# EasyEDA Pro project 21届智能车+蚂蚁搬家+主驱一体PCB文件.epro, schematic Schematic4

## Sheets
1 核心板: Board Name: V4.0(20260210); Create Date: 2026-02-10; Page Name: 核心板; Project Name: NXP_micropython主驱一体; Schematic Name: Schematic4; Update Date: 2026-02-18; BladeWidth: 10; Company: 嘉立创EDA; Page Size: A4; RegionStart: 1; ShowBorder: 1; TitleBlock: 1; TitleBlockPosition: 3; Version: V1.0; XRegionCount: 6; YRegionCount: 4
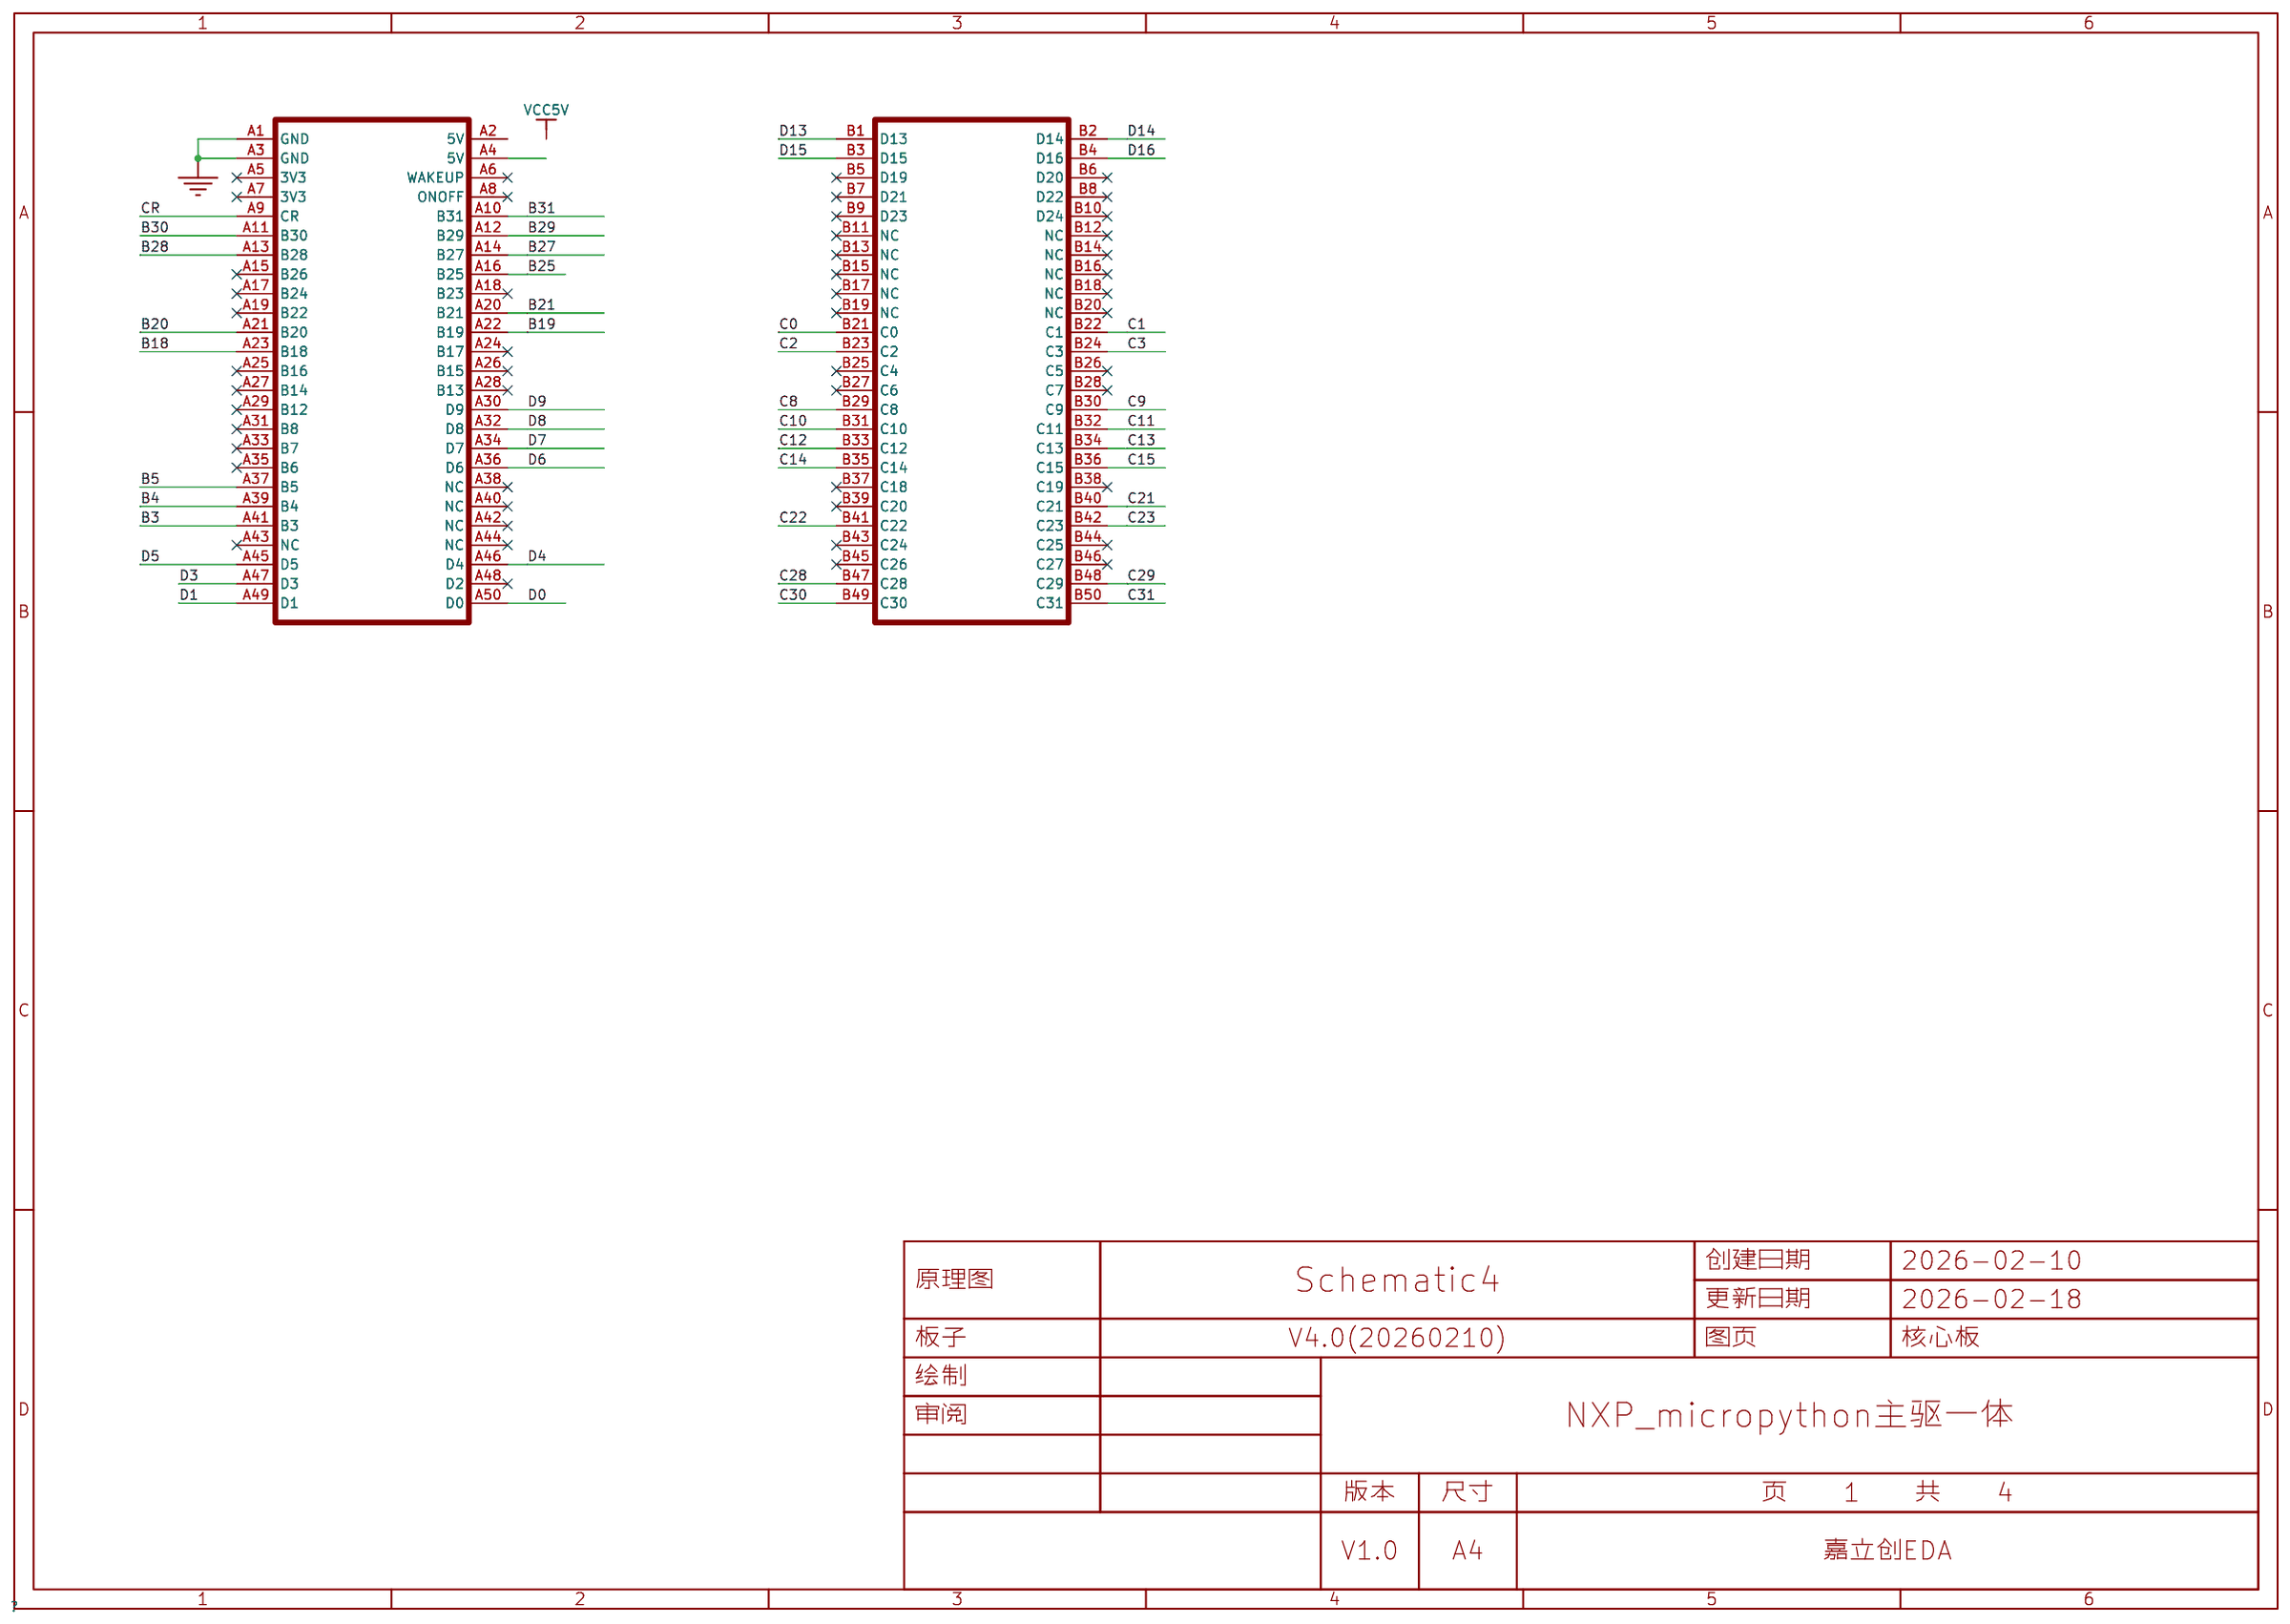
[diagram p3: 核心板]
2 电源: Page Name: 电源; Update Date: 2026-02-17
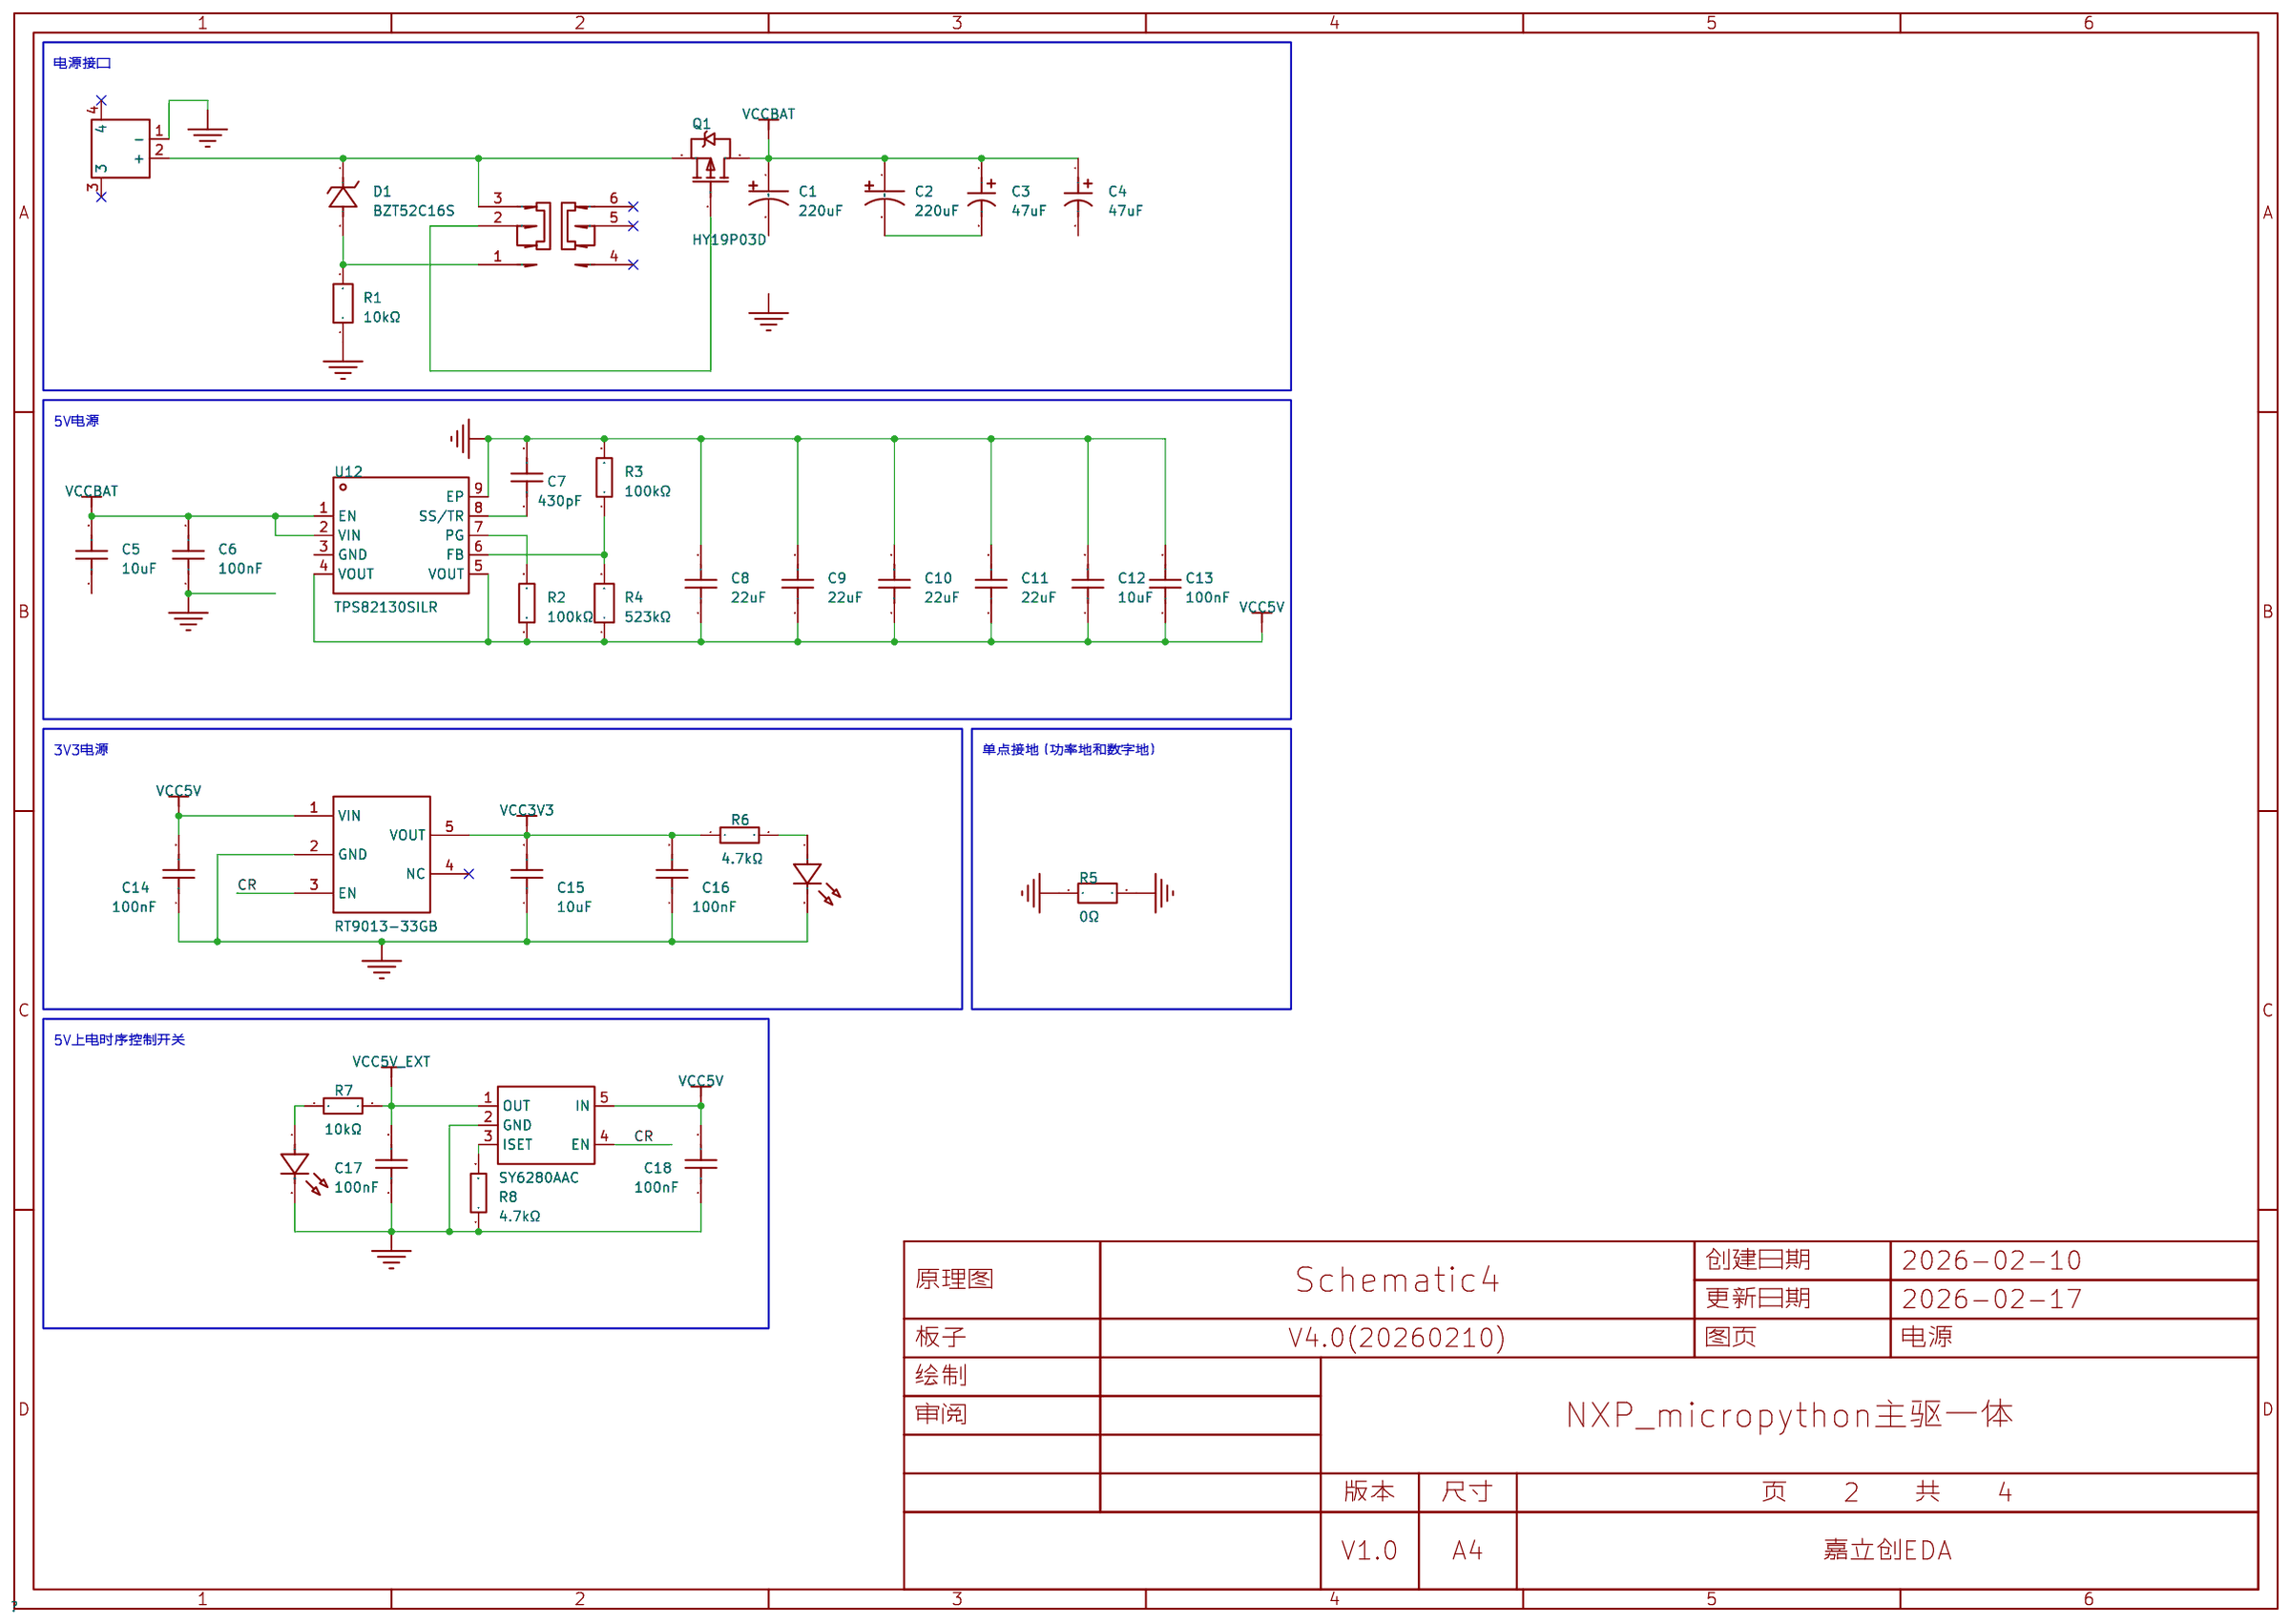
[diagram p4: 电源]
3 外设: Page Name: 外设; Update Date: 2026-02-19
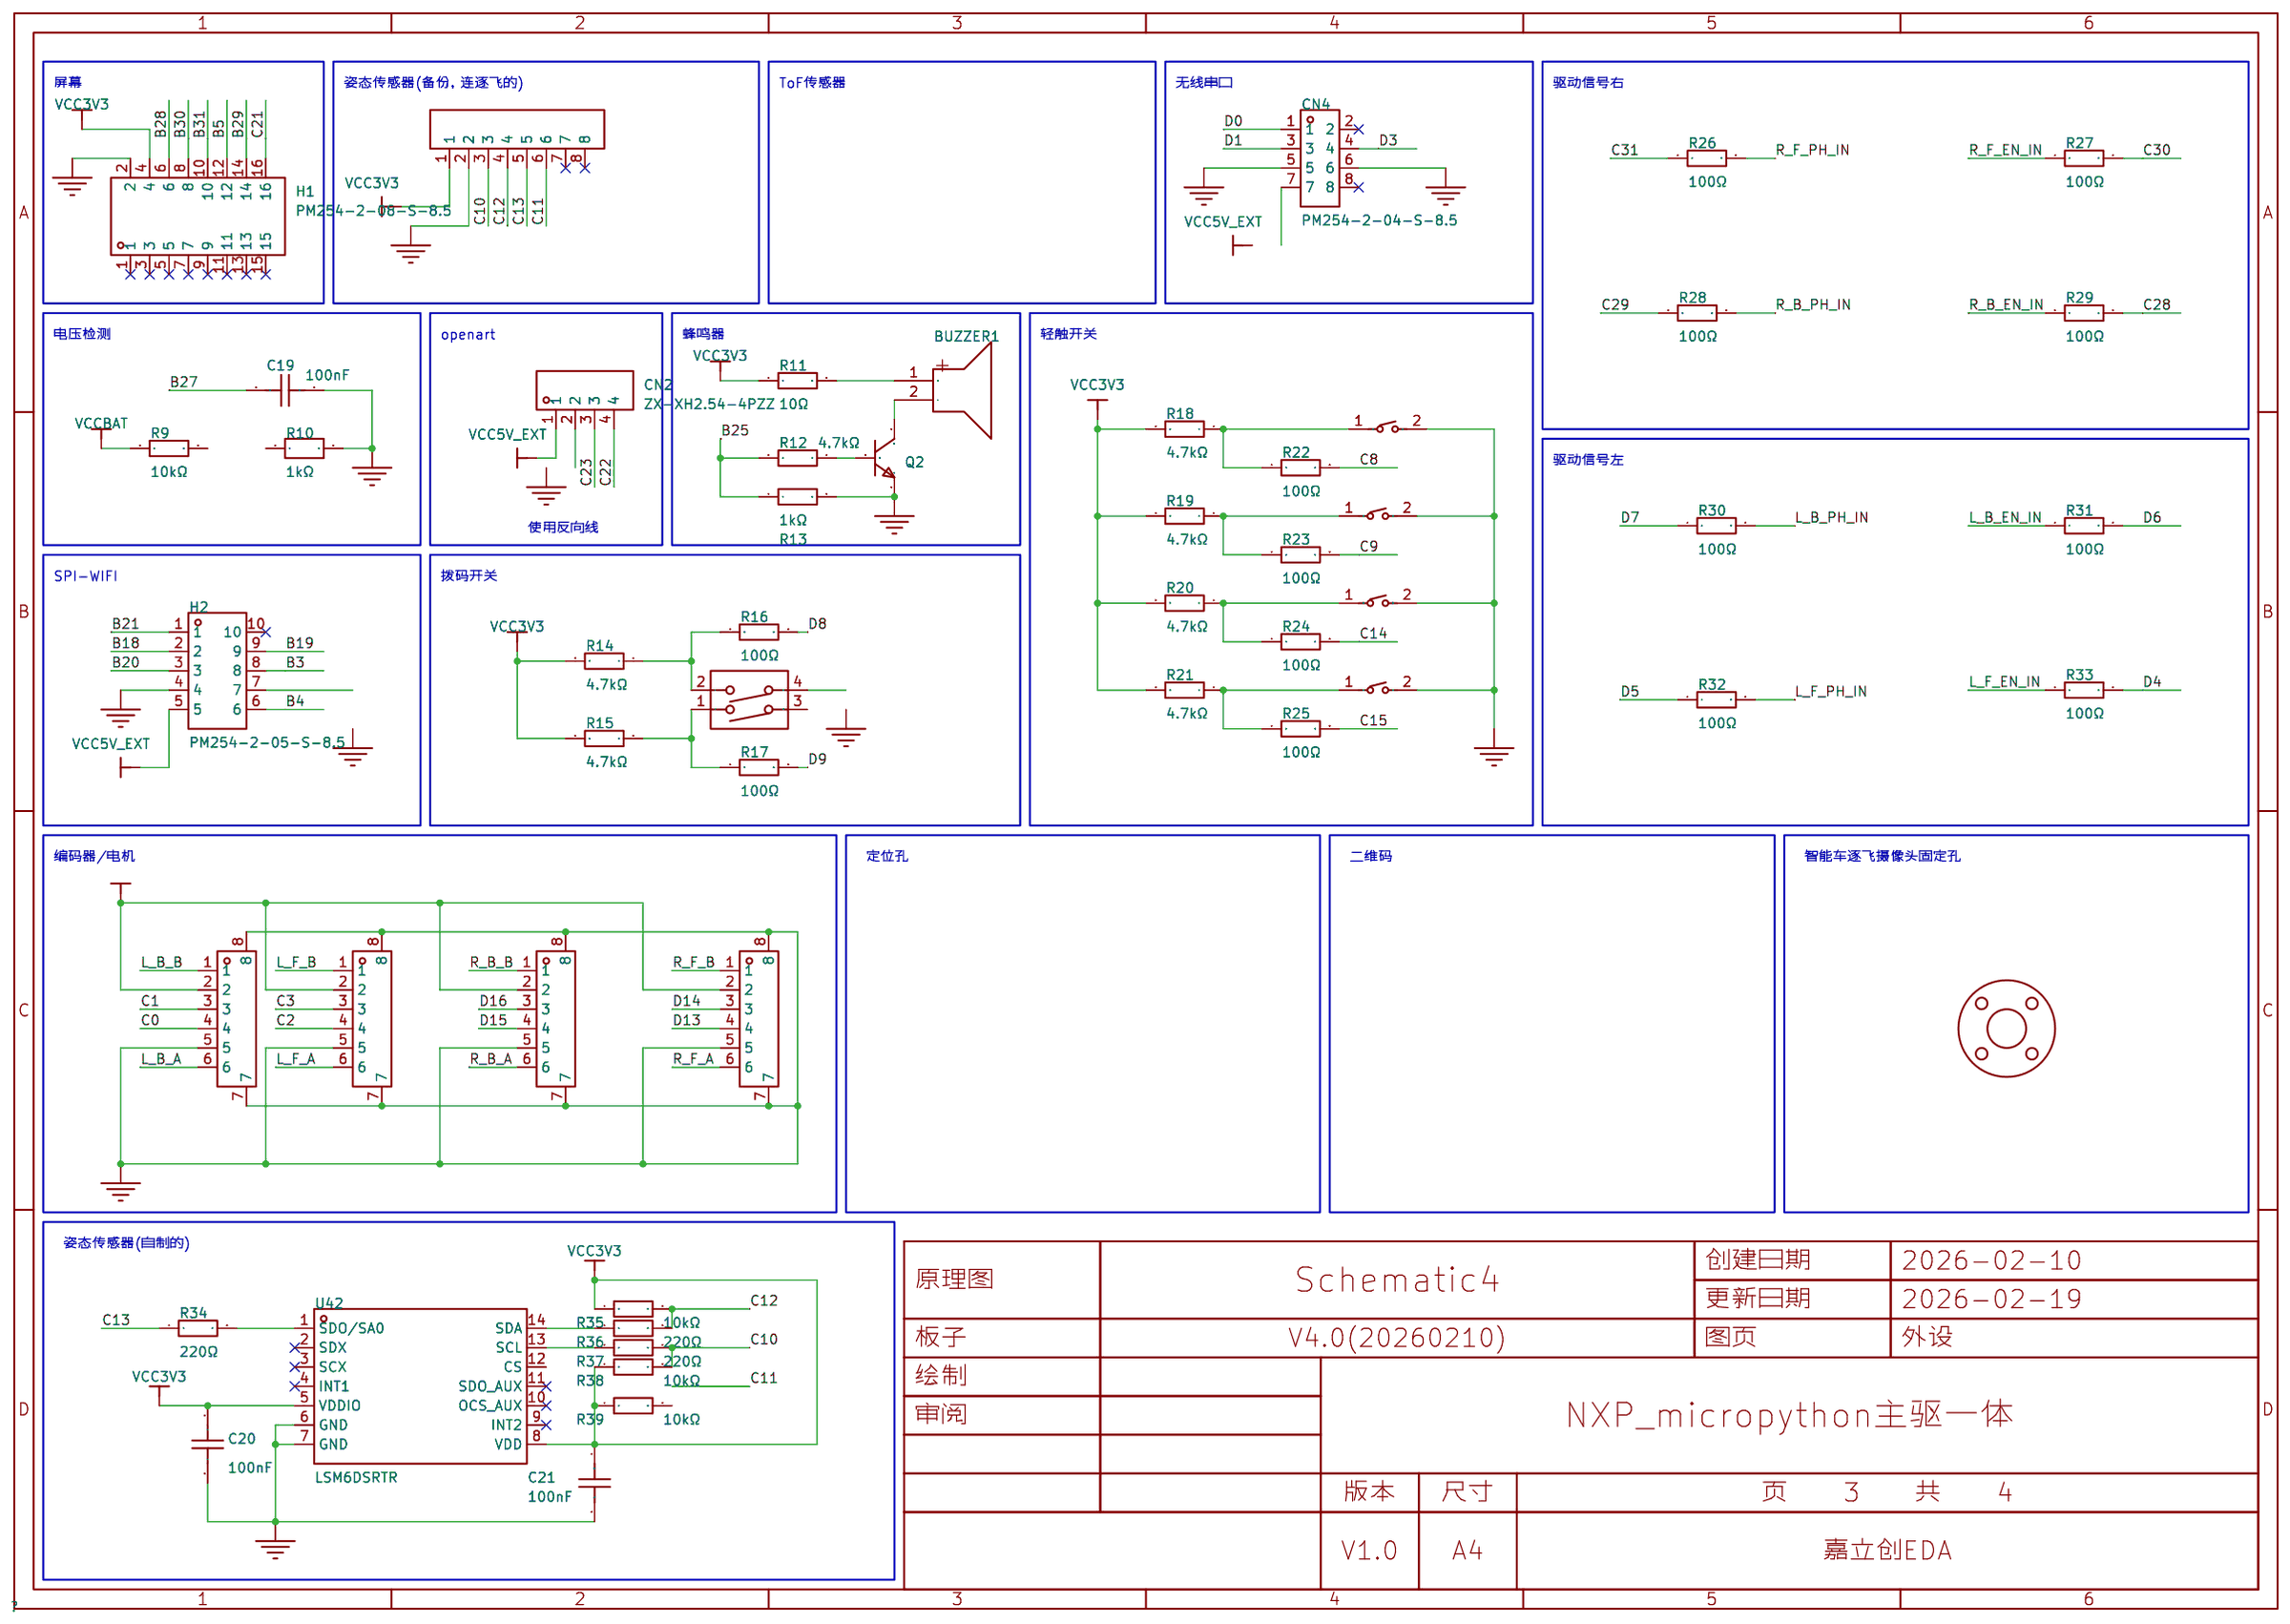
[diagram p5: 外设]
4 驱动: Page Name: 驱动; Update Date: 2026-02-17
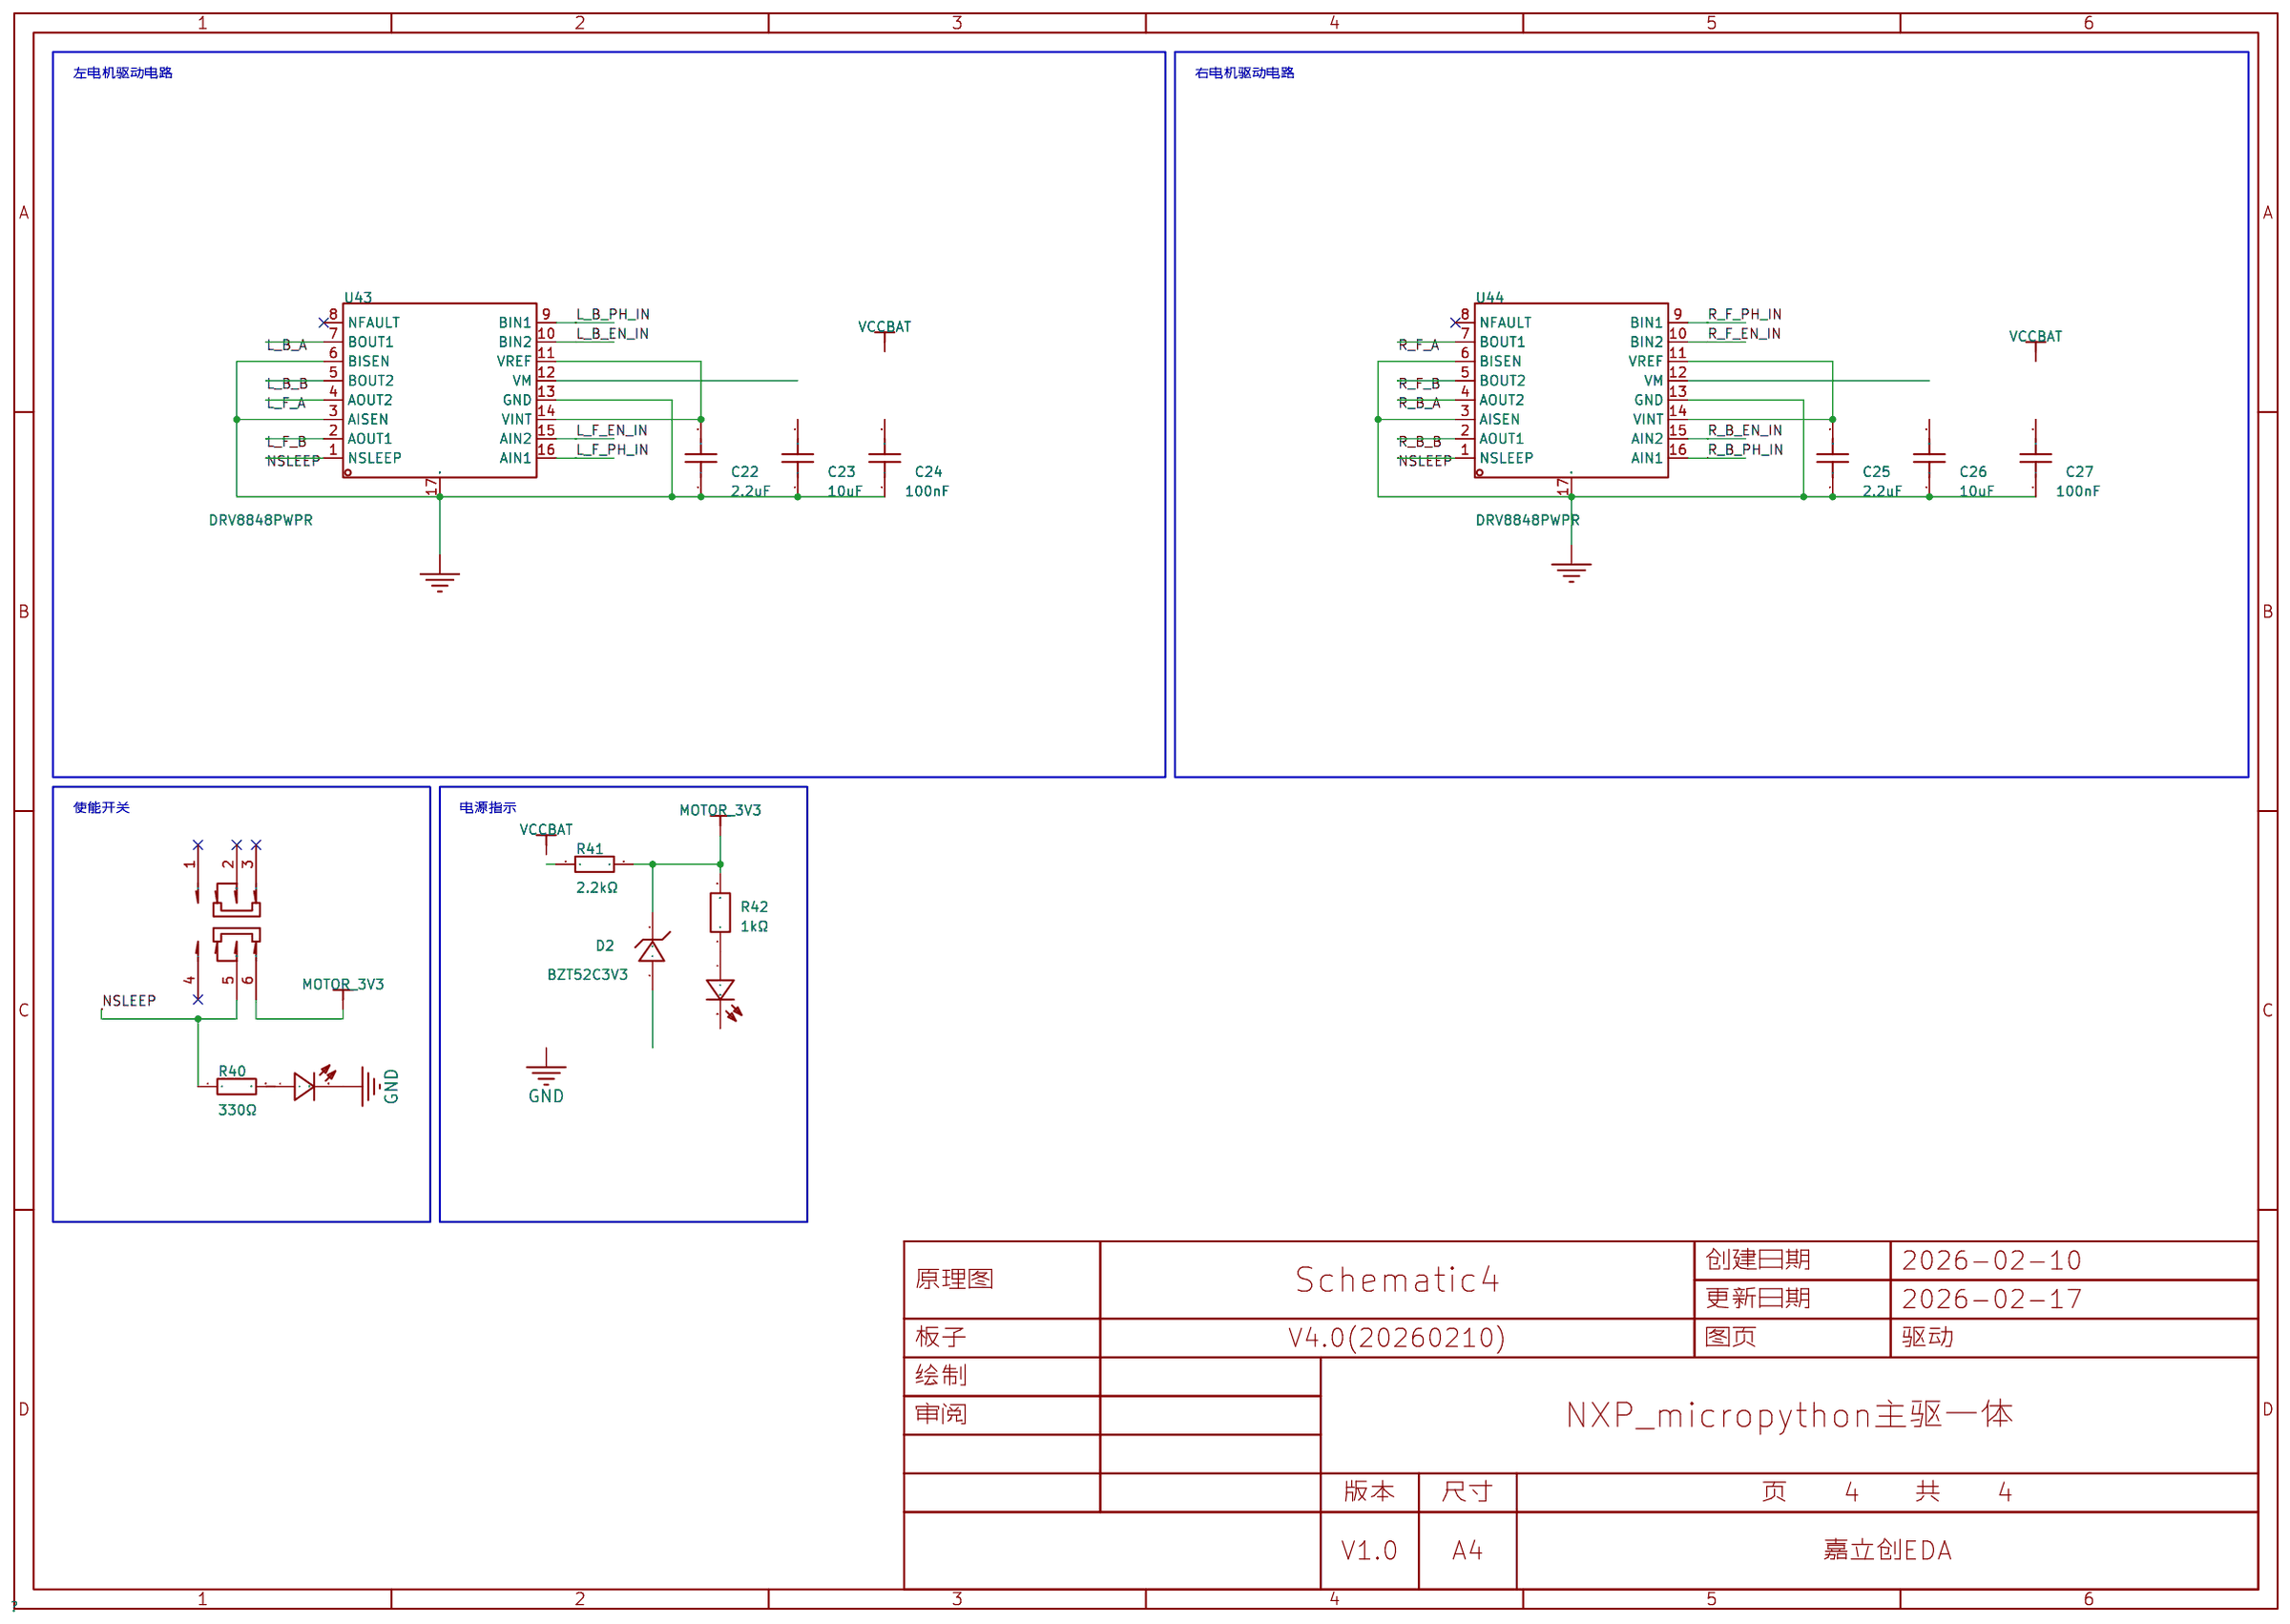
[diagram p6: 驱动]

## Parts
sheet 外设
BUZZER1  3kHz  [BUZ-TH_BD9.0-P5.00-D0.6-FD]
C19  100nF  [C0603]
C20  100nF  [C0603]
C21  100nF  [C0603]
CN2  ZX-XH2.54-4PZZ  [CONN-TH_4P-P2.50_4PIN]
CN4  PM254-2-04-S-8.5  [HDR-SMD_8P-P2.54-V-F-R2-C4-S7.1]
FH2  智能车逐飞摄像头固定孔  [智能车逐飞摄像头支架固定孔]
H1  PM254-2-08-S-8.5  [HDR-SMD_16P-P2.54-V-F-R2-C8-LS7.1]
H2  PM254-2-05-S-8.5  [HDR-SMD_10P-P2.54-V-F-R2-C5-LS7.1-1]
P5  2.54-1*8P母环保  [HDR-TH_8P-P2.54-V-F_2]
Q2  S8050 J3Y(RANGE:200-350)  [SOT-23-3_L3.0-W1.7-P0.95-LS2.9-BR]
R9  10kΩ  [R0603]
R10  1kΩ  [R0603]
R11  10Ω  [R0603]
R12  4.7kΩ  [R0603]
R13  1kΩ  [R0603]
R14  4.7kΩ  [R0603]
R15  4.7kΩ  [R0603]
R16  100Ω  [R0603]
R17  100Ω  [R0603]
R18  4.7kΩ  [R0603]
R19  4.7kΩ  [R0603]
R20  4.7kΩ  [R0603]
R21  4.7kΩ  [R0603]
R22  100Ω  [R0603]
R23  100Ω  [R0603]
R24  100Ω  [R0603]
R25  100Ω  [R0603]
R26  100Ω  [R0603]
R27  100Ω  [R0603]
R28  100Ω  [R0603]
R29  100Ω  [R0603]
R30  100Ω  [R0603]
R31  100Ω  [R0603]
R32  100Ω  [R0603]
R33  100Ω  [R0603]
R34  220Ω  [R0603]
R35  10kΩ  [R0603]
R36  220Ω  [R0603]
R37  220Ω  [R0603]
R38  10kΩ  [R0603]
R39  10kΩ  [R0603]
SW3  DSWB02LHGET  [SW-TH_DSWB02LHGET]
U8  ZX-QC34-2TPDZ  [KEY-SMD_L3.9-W3.0-LS5.0-EH]
U9  ZX-QC34-2TPDZ  [KEY-SMD_L3.9-W3.0-LS5.0-EH]
U10  ZX-QC34-2TPDZ  [KEY-SMD_L3.9-W3.0-LS5.0-EH]
U11  ZX-QC34-2TPDZ  [KEY-SMD_L3.9-W3.0-LS5.0-EH]
U42  LSM6DSRTR  [LGA-14_L3.0-W2.5-P0.50-BR]
U46  ZX-ZH1.5-6PLT  [CONN-SMD_6P-P1.50_ZX-ZH1.5-6PLT]
U47  ZX-ZH1.5-6PLT  [CONN-SMD_6P-P1.50_ZX-ZH1.5-6PLT]
U48  ZX-ZH1.5-6PLT  [CONN-SMD_6P-P1.50_ZX-ZH1.5-6PLT]
U49  ZX-ZH1.5-6PLT  [CONN-SMD_6P-P1.50_ZX-ZH1.5-6PLT]
sheet 核心板
U3  RT1021_BTB_CoreBoard  [RT1021_BTB_COREBOARD]  (sections 1,2)
sheet 电源
C1  220uF  [CAP-SMD_BD6.3-L6.6-W6.6-LS7.2-R-RD]
C2  220uF  [CAP-SMD_BD6.3-L6.6-W6.6-LS7.2-R-RD]
C3  47uF  [CAP-SMD_BD5.0-L5.3-W5.3-LS5.9-FD]
C4  47uF  [CAP-SMD_BD5.0-L5.3-W5.3-LS5.9-FD]
C5  10uF  [C0603]
C6  100nF  [C0603]
C7  430pF  [C0603]
C8  22uF  [C0603]
C9  22uF  [C0603]
C10  22uF  [C0603]
C11  22uF  [C0603]
C12  10uF  [C0603]
C13  100nF  [C0603]
C14  100nF  [C0603]
C15  10uF  [C0603]
C16  100nF  [C0603]
C17  100nF  [C0603]
C18  100nF  [C0603]
CN9  XT30PW-M30.G.Y  [CONN-TH_XT30PW-M]
D1  BZT52C16S  [SOD-323_L1.7-W1.3-LS2.6-RD]
Q1  HY19P03D  [TO-252-2_L6.6-W6.1-P4.57-LS9.9-TL-CW]
R1  10kΩ  [R0603]
R2  100kΩ  [R0603]
R3  100kΩ  [R0603]
R4  523kΩ  [R0603]
R5  0Ω  [R1206]
R6  4.7kΩ  [R0603]
R7  10kΩ  [R0603]
R8  4.7kΩ  [R0603]
U1  RT9013-33GB  [SOT-23-5_L3.0-W1.7-P0.95-LS2.8-BR]
U2  42-51/GHC-YW2X2K/3T  [LED-SMD_L1.6-W0.8-FD_GREEN-1]
U4  42-51/GHC-YW2X2K/3T  [LED-SMD_L1.6-W0.8-FD_GREEN-1]
U6  SY6280AAC  [SOT-23-5_L3.0-W1.7-P0.95-LS2.8-BR]
U12  TPS82130SILR  [USIP-8_L3.0-W2.8-P0.65-TL-EP]
U41  SS-3235S-L1  [SW-SMD_SS-3235S-LX]
sheet 驱动
C22  2.2uF  [C0603]
C23  10uF  [C0603]
C24  100nF  [C0603]
C25  2.2uF  [C0603]
C26  10uF  [C0603]
C27  100nF  [C0603]
D2  BZT52C3V3  [SOD-123_L2.8-W1.8-LS3.7-RD]
LED1  Blue  [LEDC1608(0603)]
LED2  =Color  [LEDC1608(0603)]
R40  330Ω  [R0603]
R41  2.2kΩ  [R0603]
R42  1kΩ  [R0603]
U5  SS-3235S-L1  [SW-SMD_SS-3235S-LX]
U43  DRV8848PWPR  [HTSSOP-16_L5.0-W4.4-P0.65-LS6.4-BL-EP]
U44  DRV8848PWPR  [HTSSOP-16_L5.0-W4.4-P0.65-LS6.4-BL-EP]

## Library data of the parts
BUZZER1 = HNB09A03: 驱动方式:有源(内含驱动线路);构造类型:电磁式;频率:3kHz;声压(SPL):85dB;; LCSC Part Name: 电磁式有源一体蜂鸣器HNB09A03; Supplier Part: C96102; Manufacturer: 华能; Supplier Footprint: 插件,D=9mm; JLCPCB Part Class: 扩展库; Datasheet: https://atta.szlcsc.com/upload/public/pdf/source/20241128/61C4C8C3938BB25F7C38FBE94CCE8DCF.pdf; Supplier: LCSC; Driver Circuitry: 有源(内含驱动线路); Technology: 电磁式; Voltage - Supply: 1.5V~4.5V; Current Consumption: 30mA; Sound Pressure Level(SPL): 85dB; Diameter(φD): 9mm; Height: 5.5mm; Operating Temperature: -20℃~+70℃
C6 C13 C14 C16-C21 C24 C27 = CL10B104KB8NNNC: 容值:100nF;精度:±10%;额定电压:50V;温度系数:X7R;; LCSC Part Name: 100nF ±10% 50V; Supplier Part: C1591; Manufacturer: SAMSUNG(三星); Supplier Footprint: 0603; JLCPCB Part Class: 扩展库; Datasheet: https://item.szlcsc.com/datasheet/CL10B104KB8NNNC/1943.html; Supplier: LCSC; Tolerance: ±10%; Voltage Rating: 50V; Temperature Coefficient: X7R
CN2 = ZX-XH2.54-4PZZ: 插针结构:1x4P;间距:2.5mm;安装方式:直插;参考系列:XH;总PIN数:4P;排数:1;每排PIN数:4;行距:-;额定电流:3A;触头材质:黄铜;触头镀层:锡;工作温度:-25℃~+85℃;; LCSC Part Name: 1x4P 间距:2.5mm 直插 系列:XH; Supplier Part: C7429634; Manufacturer: Megastar(兆星); Supplier Footprint: 插件,P=2.5mm; JLCPCB Part Class: 扩展库; Datasheet: https://item.szlcsc.com/datasheet/ZX-XH2.54-4PZZ/8427551.html; Supplier: LCSC; Pins Structure: 1x4P; Pitch: 2.5mm; Mounting Type: 直插; Reference Series: XH; Number of Pins: 4P; Number of Rows: 1; Number of PINs Per Row: 4; Current Rating: 3A; Contact Material: 黄铜; Contact Plating: 锡; Operating Temperature: -25℃~+85℃; Voltage Rating: 250V; Plastic Material: PA66; Flame Retardant Rating: UL94V-0; Color: 白色; Z-Height of the Board: 7mm; X-Length of Bottom Edge on Board (Spacing Line): 12.5mm; Y-Width of Bottom Edge on Board: 5.9mm
CN4 = PM254-2-04-S-8.5: 插孔结构:2x4P;间距:2.54mm;行距:2.54mm;圆孔/方孔:方孔;安装方式:立贴;排数:双排;总孔位数:8P;额定电流:3A;插孔方向:顶部;塑高:8.5mm;触头材质:铜合金;工作温度:-40℃~+105℃;; LCSC Part Name: 2x4P 间距:2.54mm 立贴; Supplier Part: C3975149; Manufacturer: HCTL(华灿天禄); Supplier Footprint: SMD,P=2.54mm; JLCPCB Part Class: 扩展库; Datasheet: https://item.szlcsc.com/datasheet/PM254-2-04-S-8.5/4543700.html; Supplier: LCSC; Holes Structure: 2x4P; Pitch: 2.54mm; Row Spacing: 2.54mm; Circular Hole / Square Hole: 方孔; Mounting Type: 立贴; Number of Rows: 双排; Number of Positions: 8P; Current Rating: 3A; Holes Direction: 顶部; Insulation Height: 8.5mm; Contact Material: 铜合金; Operating Temperature: -40℃~+105℃
FH2 = 智能车逐飞摄像头固定孔: 3DModel: 逐飞摄像头法兰盘-Body
H1 = PM254-2-08-S-8.5: 插孔结构:2x8P;间距:2.54mm;行距:2.54mm;圆孔/方孔:方孔;安装方式:立贴;排数:双排;总孔位数:16P;额定电流:3A;插孔方向:顶部;塑高:8.5mm;触头材质:铜合金;工作温度:-40℃~+105℃;; LCSC Part Name: 2x8P 间距:2.54mm 立贴; Supplier Part: C3975153; Manufacturer: HCTL(华灿天禄); Supplier Footprint: SMD,P=2.54mm; JLCPCB Part Class: 扩展库; Datasheet: https://item.szlcsc.com/datasheet/PM254-2-08-S-8.5/4543704.html; Supplier: LCSC; Holes Structure: 2x8P; Pitch: 2.54mm; Row Spacing: 2.54mm; Circular Hole / Square Hole: 方孔; Mounting Type: 立贴; Number of Rows: 双排; Number of Positions: 16P; Current Rating: 3A; Holes Direction: 顶部; Insulation Height: 8.5mm; Contact Material: 铜合金; Operating Temperature: -40℃~+105℃
H2 = PM254-2-05-S-8.5: 插孔结构:2x5P;间距:2.54mm;行距:2.54mm;圆孔/方孔:方孔;安装方式:立贴;排数:双排;总孔位数:10P;额定电流:3A;插孔方向:顶部;塑高:8.5mm;触头材质:铜合金;工作温度:-40℃~+105℃;; LCSC Part Name: 2x5P 间距:2.54mm 立贴; Supplier Part: C3975150; Manufacturer: HCTL(华灿天禄); Supplier Footprint: SMD,P=2.54mm; JLCPCB Part Class: 扩展库; Datasheet: https://item.szlcsc.com/datasheet/PM254-2-05-S-8.5/4543701.html; Supplier: LCSC; Holes Structure: 2x5P; Pitch: 2.54mm; Row Spacing: 2.54mm; Circular Hole / Square Hole: 方孔; Mounting Type: 立贴; Number of Rows: 双排; Number of Positions: 10P; Current Rating: 3A; Holes Direction: 顶部; Insulation Height: 8.5mm; Contact Material: 铜合金; Operating Temperature: -40℃~+105℃
P5 = 2.54-1*8P母环保: 插孔结构:1x8P;间距:2.54mm;行距:-;圆孔/方孔:方孔;安装方式:直插;排数:单排;总孔位数:8P;插孔方向:顶部;塑高:-;触头材质:-;触头镀层:-;; LCSC Part Name: 1x8P 间距:2.54mm 直插; Supplier Part: C27438; Manufacturer: BOOMELE(博穆精密); Supplier Footprint: 插件,P=2.54mm; JLCPCB Part Class: 扩展库; Datasheet: https://item.szlcsc.com/datasheet/2.54-1*8P%25E6%25AF%258D%25E7%258E%25AF%25E4%25BF%259D/28187.html; Supplier: LCSC; Holes Structure: 1x8P; Pitch: 2.54mm; Circular Hole / Square Hole: 方孔; Mounting Type: 直插; Number of Rows: 单排; Number of Positions: 8P; Holes Direction: 顶部
Q2 = S8050 J3Y(RANGE:200-350): 晶体管类型:NPN;集电极电流(Ic):500mA;集射极击穿电压(Vceo):25V;功率(Pd):300mW;直流电流增益(hFE@Ic,Vce):200@500mA,1V;; LCSC Part Name: NPN 电流:500mA 耐压:25V H档(200-350); Supplier Part: C2146; Manufacturer: CJ(江苏长电/长晶); Supplier Footprint: SOT-23; JLCPCB Part Class: 基础库; Datasheet: https://atta.szlcsc.com/upload/public/pdf/source/20231013/FF37B6A000E6CDA75C9C999D2E78731F.pdf; Supplier: LCSC; Transistor Type: NPN; Collector Current (Ic): 500mA; Collector-Emitter Breakdown Voltage (Vceo): 25V; Power Dissipation (Pd): 300mW; DC Current Gain (hFE@Ic,Vce): 200@500mA,1V; Transition Frequency (fT): 150MHz; Collector Cut-Off Current (Icbo): 100nA; Collector-Emitter Saturation Voltage (VCE(sat)@Ic,Ib): 600mV@500mA,50mA; Operating Temperature: -55℃~+150℃
R7 R9 R35 R38 R39 = 0603WAF1002T5E: 电阻类型:厚膜电阻;阻值:10kΩ;精度:±1%;功率:100mW;最大工作电压:75V;温度系数:±100ppm/℃;; LCSC Part Name: 厚膜电阻 10kΩ ±1% 100mW; Supplier Part: C25804; Manufacturer: UNI-ROYAL(厚声); Supplier Footprint: 0603; JLCPCB Part Class: 基础库; Datasheet: https://atta.szlcsc.com/upload/public/pdf/source/20200306/C422600_1E6D84923E4A46A82E41ADD87F860B5C.pdf; Supplier: LCSC; Type: 厚膜电阻; Tolerance: ±1%; Power(Watts): 100mW; Overload Voltage (Max): 75V; Temperature Coefficient: ±100ppm/℃; Operating Temperature Range: -55℃~+155℃
R10 R42 = FRC0603F1001TS: 电阻类型:厚膜电阻;阻值:1kΩ;精度:±1%;功率:100mW;工作电压:75V;温度系数:±100ppm/℃;; LCSC Part Name: 1kΩ ±1% 100mW 厚膜电阻; Supplier Part: C2907002; Manufacturer: FOJAN(富捷); Supplier Footprint: 0603; JLCPCB Part Class: 扩展库; Supplier: LCSC; Type: 厚膜电阻; Tolerance: ±1%; Power(Watts): 100mW; Voltage-Supply(Max): 75V; Temperature Coefficient: ±100ppm/℃; Operating Temperature: -55℃~+155℃
R11 = 0603WAF100JT5E: 电阻类型:厚膜电阻;阻值:10Ω;精度:±1%;功率:100mW;最大工作电压:75V;温度系数:±400ppm/℃;; LCSC Part Name: 10Ω ±1% 100mW 厚膜电阻; Supplier Part: C22859; Manufacturer: UNI-ROYAL(厚声); Supplier Footprint: 0603; JLCPCB Part Class: 基础库; Datasheet: https://atta.szlcsc.com/upload/public/pdf/source/20200306/C422600_1E6D84923E4A46A82E41ADD87F860B5C.pdf; Supplier: LCSC; Type: 厚膜电阻; Tolerance: ±1%; Power(Watts): 100mW; Overload Voltage (Max): 75V; Temperature Coefficient: ±400ppm/℃; Operating Temperature Range: -55℃~+155℃
R6 R8 R12 R14 R15 R18-R21 = 0603WAF4701T5E: 电阻类型:厚膜电阻;阻值:4.7kΩ;精度:±1%;功率:100mW;最大工作电压:75V;温度系数:±100ppm/℃;; LCSC Part Name: 4.7kΩ ±1% 100mW 厚膜电阻; Supplier Part: C23162; Manufacturer: UNI-ROYAL(厚声); Supplier Footprint: 0603; JLCPCB Part Class: 基础库; Datasheet: https://atta.szlcsc.com/upload/public/pdf/source/20200306/C422600_1E6D84923E4A46A82E41ADD87F860B5C.pdf; Supplier: LCSC; Type: 厚膜电阻; Tolerance: ±1%; Power(Watts): 100mW; Overload Voltage (Max): 75V; Temperature Coefficient: ±100ppm/℃; Operating Temperature Range: -55℃~+155℃
R13 = RT0603BRD071KL: 电阻类型:薄膜电阻;阻值:1kΩ;精度:±0.1%;功率:100mW;最大工作电压:75V;温度系数:±25ppm/℃;; LCSC Part Name: 薄膜电阻 1kΩ ±0.1% 100mW; Supplier Part: C110776; Manufacturer: YAGEO(国巨); Supplier Footprint: 0603; JLCPCB Part Class: 扩展库; Datasheet: https://atta.szlcsc.com/upload/public/pdf/source/20170704/1499151282044.pdf; Supplier: LCSC; Type: 薄膜电阻; Tolerance: ±0.1%; Power(Watts): 100mW; Overload Voltage (Max): 75V; Temperature Coefficient: ±25ppm/℃; Operating Temperature Range: -55℃~+155℃
R16 R17 R22-R33 = 0603WAF1000T5E: 电阻类型:厚膜电阻;阻值:100Ω;精度:±1%;功率:100mW;最大工作电压:75V;温度系数:±200ppm/℃;; LCSC Part Name: 100Ω ±1% 100mW 厚膜电阻; Supplier Part: C22775; Manufacturer: UNI-ROYAL(厚声); Supplier Footprint: 0603; JLCPCB Part Class: 基础库; Datasheet: https://atta.szlcsc.com/upload/public/pdf/source/20200306/C422600_1E6D84923E4A46A82E41ADD87F860B5C.pdf; Supplier: LCSC; Type: 厚膜电阻; Tolerance: ±1%; Power(Watts): 100mW; Overload Voltage (Max): 75V; Temperature Coefficient: ±200ppm/℃; Operating Temperature Range: -55℃~+155℃
R34 R36 R37 = RC0603FR-07220RL: 最大工作电压:75V;工作温度范围:-55℃~+155℃;电阻长:-;精度:±1%;电阻直径:-;电阻高:-;电阻宽:-;电阻类型:厚膜电阻;阻值:220Ω;温度系数:±100ppm/℃;功率:100mW;; LCSC Part Name: 220Ω ±1%; Supplier Part: C107696; Manufacturer: YAGEO(国巨); Supplier Footprint: 0603; JLCPCB Part Class: Extended Part; Datasheet: https://atta.szlcsc.com/upload/public/pdf/source/20170818/C107696_1503051114712895062.pdf; Supplier: LCSC; Overload Voltage (Max): 75V; Operating Temperature Range: -55℃~+155℃; Tolerance: ±1%; Type: 厚膜电阻; Temperature Coefficient: ±100ppm/℃; Power(Watts): 100mW
SW3 = DSWB02LHGET: 类型:平拨,凸起式;电路结构:单刀单掷;开关位数:2位;使用寿命:-;颜色:红色;; LCSC Part Name: 拨码开关,平拨开关,DSWB02LHGET; Supplier Part: C99421; Manufacturer: YE; Supplier Footprint: 插件; JLCPCB Part Class: 扩展库; Datasheet: https://atta.szlcsc.com/upload/public/pdf/source/20230906/EFD9230F686161BBBCD1B62855702D44.pdf; Supplier: LCSC; Type: 平拨,凸起式; Circuit: 单刀单掷; Number of Positions: 2位; Lead Pitch: 2.54mm; Color: 红色
U8-U11 = ZX-QC34-2TPDZ: 电路结构:单刀单掷;按钮形状:圆形按钮;作用力:2.6N;安装方式:立贴;开关长度:3mm;开关宽度:4mm;开关高度:2mm;带支架:不带支架;触点电流:50mA;额定电压:12V;机械寿命:10万次;; LCSC Part Name: 3*4*2贴片开关带柱; Supplier Part: C7470219; Manufacturer: Megastar(兆星); Supplier Footprint: SMD; JLCPCB Part Class: 扩展库; Datasheet: https://atta.szlcsc.com/upload/public/pdf/source/20230724/D2731FAADF93973E25928DE23F241F8A.pdf; Supplier: LCSC; Circuit: 单刀单掷; Actuator Style: 圆形按钮; Operating Force: 2.6N; Mounting Style: 立贴; Switch Length: 3mm; Switch Width: 4mm; Switch Height: 2mm; Strike Gundam: 不带支架; Contact Current: 50mA; Voltage Rating: 12V; Actuator/Cap Color: 黑色; Pin Style: 鸥翼型; Mechanical Life: 10万次; Operating Temperature: -30℃~+80℃
U42 = LSM6DSRTR: Supplier Part: C784817; Manufacturer: ST(意法半导体); Supplier Footprint: LGA-14(2.5x3); JLCPCB Part Class: 扩展库; Datasheet: https://atta.szlcsc.com/upload/public/pdf/source/20200917/C784817_588B181F536F08BA56850445B1DD436C.pdf; Supplier: LCSC; Sensor Type: 加速度计陀螺仪; Operating Temperature: -40℃~+85℃
U46-U49 = ZX-ZH1.5-6PLT: 插针结构:1x6P;间距:1.5mm;安装方式:立贴;参考系列:ZH;总PIN数:6P;排数:1;每排PIN数:6;行距:-;额定电流:1A;触头材质:黄铜;触头镀层:锡;工作温度:-25℃~+85℃;; LCSC Part Name: 1x6P 间距:1.5mm 立贴 系列:ZH; Supplier Part: C19272418; Manufacturer: Megastar(兆星); Supplier Footprint: SMD,P=1.5mm; JLCPCB Part Class: 扩展库; Datasheet: https://item.szlcsc.com/datasheet/ZX-ZH1.5-6PLT/20550429.html; Supplier: LCSC; Pins Structure: 1x6P; Pitch: 1.5mm; Mounting Type: 立贴; Reference Series: ZH; Number of Pins: 6P; Number of Rows: 1; Number of PINs Per Row: 6; Current Rating: 1A; Contact Material: 黄铜; Contact Plating: 锡; Operating Temperature: -25℃~+85℃; Voltage Rating: 250V; Plastic Material: LCP; Supplementary Features: 辅助焊脚; Color: 米色; Z-Height of the Board: 5.1mm; X-Length of Bottom Edge on Board (Spacing Line): 12mm; Y-Width of Bottom Edge on Board: 5.2mm
U3 = RT1021_BTB_CoreBoard: 逐飞科技 RT1021_BTB_CoreBoard 核心板; Published: 8-Jun-2000; Revision: July-2002: Re-released for DXP Platform.; Publisher: Altium Limited; Imax: 50mA; DCR: .1m; Price(RMB): 0.000
C1 C2 = VZT221M1CTR-0606ACS: 容值:220uF;精度:±20%;额定电压:16V;电容体直径:6.3mm;电容体长度:5.8mm;纹波电流:-;等效串联电阻:-;工作寿命:2000hrs@105℃;工作温度:-45℃~+105℃;; LCSC Part Name: 220uF ±20% 16V; Supplier Part: C286136; Manufacturer: lelon(立隆); Supplier Footprint: SMD,D6.3xL5.8mm; JLCPCB Part Class: Extended Part; Datasheet: https://atta.szlcsc.com/upload/public/pdf/source/20180921/C286136_B135157883311A80483BB6A4D6974578.pdf; Supplier: LCSC; Tolerance: ±20%; Rated Voltage: 16V; φD: 6.3mm; L: 5.8mm; Lifetime @ Temp: 2000hrs@105℃; Operating Temperature: -45℃~+105℃
C3 C4 = JVJ25V47M5x5: 容值:47uF;精度:±20%;额定电压:25V;纹波电流:35mA@120Hz;; LCSC Part Name: 47uF ±20% 25V; Supplier Part: C46550408; Manufacturer: JIERR(捷而瑞); Supplier Footprint: SMD,D5xL5.4mm; JLCPCB Part Class: 扩展库; Datasheet: https://item.szlcsc.com/datasheet/JVJ25V47M5x5/48680102.html; Supplier: LCSC; Tolerance: ±20%; Voltage Rating: 25V; Ripple Current: 35mA@120Hz; Diameter: 5mm; Height - Seated (Max): 5.4mm; Lifetime: 2000hrs@105℃; Operating Temperature: -55℃~+105℃
C5 C12 C15 C23 C26 = CL10A106MA8NRNC: 容值:10uF;精度:±20%;额定电压:25V;温度系数:X5R;; LCSC Part Name: 10uF ±20% 25V; Supplier Part: C96446; Manufacturer: SAMSUNG(三星); Supplier Footprint: 0603; JLCPCB Part Class: 基础库; Datasheet: https://item.szlcsc.com/datasheet/CL10A106MA8NRNC/97651.html; Supplier: LCSC; Tolerance: ±20%; Voltage Rating: 25V; Temperature Coefficient: X5R
C7 = CC0603JRNPO9BN431: 容值:430pF;精度:±5%;额定电压:50V;材质(温度系数):NP0;; LCSC Part Name: 430pF ±5% 50V; Supplier Part: C309472; Manufacturer: YAGEO(国巨); Supplier Footprint: 0603; JLCPCB Part Class: 扩展库; Datasheet: https://atta.szlcsc.com/upload/public/pdf/source/20191125/C354976_4A9AE911FA5758D8C0A36AE6394FD4D7.pdf; Supplier: LCSC; Tolerance: ±5%; Voltage Rated: 50V; Temperature Coefficient: NP0
C8-C11 = CGA0603X5R226M160JT: 容值:22uF;精度:±20%;额定电压:16V;温度系数:X5R;; LCSC Part Name: 22uF ±20% 16V; Supplier Part: C6119868; Manufacturer: HRE(芯声); Supplier Footprint: 0603; JLCPCB Part Class: 扩展库; Datasheet: https://item.szlcsc.com/datasheet/CGA0603X5R226M160JT/7062574.html; Supplier: LCSC; Tolerance: ±20%; Voltage Rating: 16V; Temperature Coefficient: X5R
CN9 = XT30PW-M30.G.Y: 类别:-;类型1:-;; LCSC Part Name: AMASS(艾迈斯)航模插头 卧式弯脚 XT30PW-M公头; Supplier Part: C431092; Manufacturer: AMASS(艾迈斯); JLCPCB Part Class: 扩展库; Datasheet: https://item.szlcsc.com/datasheet/XT30PW-M30.G.Y/426930.html; Supplier: LCSC; Type: 航模插头; RatedVoltage: DC 500V; InterfaceType: 公头; RatedCurrent: 15A; RecommendedWireGauge: 16/18/20AWG; contact resistance: 1.2mΩ; specifications: 2pin
D1 = BZT52C16S_C19077449: 二极管配置:独立式;稳压值(标称值):16V;稳压值(范围):15.3V~17.1V;耗散功率(Pd):200mW;; LCSC Part Name: 表面贴装齐纳二极管; Supplier Part: C19077449; Manufacturer: R+O(宏嘉诚); Supplier Footprint: SOD-323; JLCPCB Part Class: 扩展库; Datasheet: https://item.szlcsc.com/datasheet/BZT52C16S/20275534.html; Supplier: LCSC; Diode Configuration: 独立式; Zener Voltage(Nom): 16V; Reverse Leakage Current (Ir): 100nA; Zener Voltage(Range): 15.3V~17.1V; Pd - Power Dissipation: 200mW; Impedance(Zzt): 40Ω; Impedance(Zzk): 200Ω; Operating Junction Temperature Range: -55℃~+150℃
Q1 = HY19P03D: 类型:P沟道;漏源电压(Vdss):30V;连续漏极电流(Id):90A;功率(Pd):50W;导通电阻(RDS(on)@Vgs,Id):6mΩ@10V,45A;阈值电压(Vgs(th)@Id):3V@250uA;; LCSC Part Name: P沟道 耐压:30V 电流:90A; Supplier Part: C122492; Manufacturer: HUAYI(华羿微); Supplier Footprint: TO-252-2; Datasheet: https://atta.szlcsc.com/upload/public/pdf/source/20170728/C122492_1501225751911848809.pdf; Supplier: LCSC; Type: P沟道; Drain Source Voltage (Vdss): 30V; Continuous Drain Current (Id): 90A; Power Dissipation (Pd): 50W; Drain Source On Resistance (RDS(on)@Vgs,Id): 6mΩ@10V,45A; Gate Threshold Voltage (Vgs(th)@Id): 3V@250uA
R1 = FRC0603J103 TS: 电阻类型:厚膜电阻;阻值:10kΩ;精度:±5%;功率:100mW;工作电压:75V;温度系数:±100ppm/℃;; LCSC Part Name: 10kΩ ±5% 100mW 厚膜电阻; Supplier Part: C2930027; Manufacturer: FOJAN(富捷); Supplier Footprint: 0603; JLCPCB Part Class: 扩展库; Datasheet: https://item.szlcsc.com/datasheet/FRC0603J103%2520TS/3266960.html; Supplier: LCSC; Type: 厚膜电阻; Tolerance: ±5%; Power(Watts): 100mW; Voltage-Supply(Max): 75V; Temperature Coefficient: ±100ppm/℃; Operating Temperature: -55℃~+155℃
R2 R3 = 0603WAF1003T5E: 电阻类型:厚膜电阻;阻值:100kΩ;精度:±1%;功率:100mW;最大工作电压:75V;温度系数:±100ppm/℃;; LCSC Part Name: 100kΩ ±1% 100mW 厚膜电阻; Supplier Part: C25803; Manufacturer: UNI-ROYAL(厚声); Supplier Footprint: 0603; JLCPCB Part Class: 基础库; Datasheet: https://atta.szlcsc.com/upload/public/pdf/source/20200306/C422600_1E6D84923E4A46A82E41ADD87F860B5C.pdf; Supplier: LCSC; Type: 厚膜电阻; Tolerance: ±1%; Power(Watts): 100mW; Overload Voltage (Max): 75V; Temperature Coefficient: ±100ppm/℃; Operating Temperature Range: -55℃~+155℃
R4 = FRC0603F5233TS: 电阻类型:厚膜电阻;阻值:523kΩ;精度:±1%;功率:100mW;最大工作电压:75V;温度系数:±100ppm/℃;; LCSC Part Name: 523kΩ ±1% 100mW 厚膜电阻; Supplier Part: C5126197; Manufacturer: FOJAN(富捷); Supplier Footprint: 0603; JLCPCB Part Class: 扩展库; Datasheet: https://atta.szlcsc.com/upload/public/pdf/source/20211221/925EC7D7225764EE0046F22065062C87.pdf; Supplier: LCSC; Type: 厚膜电阻; Tolerance: ±1%; Power(Watts): 100mW; Overload Voltage (Max): 75V; Temperature Coefficient: ±100ppm/℃
R5 = RCA060RLF: 电阻类型:厚膜电阻;阻值:0Ω;功率:250mW;; LCSC Part Name: 0Ω 250mW; Supplier Part: C22356801; Manufacturer: HKR(香港电阻); Supplier Footprint: 1206; JLCPCB Part Class: 扩展库; Datasheet: https://item.szlcsc.com/datasheet/RCA060RLF/23790245.html; Supplier: LCSC; Type: 厚膜电阻; Power(Watts): 250mW; Operating Temperature: -55℃~+155℃
U1 = RT9013-33GB: 输出类型:固定;输出极性:正;输出通道数:1;最大输入电压:5.5V;输出电压:3.3V;压差:400mV@(500mA);静态电流(地电流):-;输出电流:500mA;电源纹波抑制比(PRSS):50dB@(10kHz);噪声:-;特性:-;; LCSC Part Name: Vin=5.5V Vout=3.3V 500mA 50dB@(10kHz); Supplier Part: C47773; Manufacturer: RICHTEK(台湾立锜); Supplier Footprint: SOT-23-5; JLCPCB Part Class: Extended Part; Datasheet: https://atta.szlcsc.com/upload/public/pdf/source/20150504/1457707282459.pdf; Supplier: LCSC; Output Type: 固定; Output Polarity: 正; Number of Outputs: 1; Maximum Input Voltage: 5.5V; Output Voltage: 3.3V; Dropout Voltage: 400mV@(500mA); Output Current: 500mA; Power Supply Rejection Ratio (PRSS): 50dB@(10kHz)
U2 U4 = 42-51/GHC-YW2X2K/3T: 发光颜色:翠绿色;正向电流:-;主波长:520nm~535nm;发光强度:2850mcd;; LCSC Part Name: 正发光贴片灯 颜色正绿色 发光二极管; Supplier Part: C5136797; Manufacturer: EVERLIGHT(亿光); Supplier Footprint: 0603; JLCPCB Part Class: 扩展库; Datasheet: https://atta.szlcsc.com/upload/public/pdf/source/20220916/FBE88CF67A3FC292A254CF6ACE30EBDE.pdf; Supplier: LCSC; Emitted Color: 翠绿色; Dominant Wavelength: 520nm~535nm; Luminous Intensity: 2850mcd
U6 = SY6280AAC: Supplier Part: C9900003867; Supplier Footprint: SOT-23-5; JLCPCB Part Class: 扩展库; Supplier: LCSC
U12 = TPS82130SILR: TPS82130 TPS82130 具有集成电感的 3A 17V 降压转换器; Supplier Part: C473914; Manufacturer: TI(德州仪器); Supplier Footprint: USIP-8; JLCPCB Part Class: 扩展库; Datasheet: https://www.ti.com/cn/lit/gpn/tps82130; Supplier: LCSC
U5 U41 = SS-3235S-L1: 电路结构:双刀双掷;安装方式:卧贴;开关颜色:黑色;额定电流:50mA;额定电压:12V;工作寿命:1万次;; LCSC Part Name: 柄长2mm 卧贴双档 滑动开关; Supplier Part: C500055; Manufacturer: XKB Connection(中国星坤); Supplier Footprint: SMD,9.1x3.6mm; JLCPCB Part Class: 扩展库; Datasheet: https://item.szlcsc.com/datasheet/SS-3235S-L1/512181.html; Supplier: LCSC; Circuit: 双刀双掷; Actuator Style: 矩形柱状; Termination Style: 鸥翼型; Length: 9.1mm; Width: 3.55mm; Switch Height: 3.2mm; Mounting Type: 卧贴; Actuator Color: 黑色; Current Rating: 50mA; Voltage Rating: 12V; Life: 1万次; Operating Temperature: -40℃~+85℃
C22 C25 = CGA0603X5R225K250JT: 容值:2.2uF;精度:±10%;额定电压:25V;温度系数:X5R;; LCSC Part Name: 2.2uF ±10% 25V; Supplier Part: C6119859; Manufacturer: HRE(芯声); Supplier Footprint: 0603; JLCPCB Part Class: 扩展库; Datasheet: https://item.szlcsc.com/datasheet/CGA0603X5R225K250JT/7062565.html; Supplier: LCSC; Tolerance: ±10%; Voltage Rating: 25V; Temperature Coefficient: X5R
D2 = BZT52C3V3_C2112: 二极管配置:独立式;稳压值(标称值):3.3V;稳压值(范围):3.1V~3.5V;精度:-;功率:350mW;反向电流(Ir):5uA@1V;阻抗(Zzt):95Ω;; LCSC Part Name: 3.3V 350mW; Supplier Part: C2112; Manufacturer: CJ(江苏长电/长晶); Supplier Footprint: SOD-123; JLCPCB Part Class: Extended Part; Datasheet: https://atta.szlcsc.com/upload/public/pdf/source/20170919/C2112_1505799672426977594.pdf; Supplier: LCSC; Diode Configuration: 独立式; Zener Voltage (Nom): 3.3V; Zener Voltage (Range): 3.1V~3.5V; Power Dissipation: 350mW; Reverse Leakage Current (Ir): 5uA@1V; Zener Impedance (Zzt): 95Ω
LED1 = LED Chip Blue: Published: 8-Jun-2000; Revision: July-2002: Re-released for DXP Platform.; Publisher: Altium Limited; Price(RMB): 0.00; Origin Footprint 2: LEDC2012(0805); Origin Footprint 3: LEDC3216(1206)
LED2 = LED Chip Red: Published: 8-Jun-2000; Revision: July-2002: Re-released for DXP Platform.; Publisher: Altium Limited; Price(RMB): 0.00; Origin Footprint 2: LEDC2012(0805); Origin Footprint 3: LEDC3216(1206)
R40 = 0603WAF3300T5E: 电阻类型:厚膜电阻;阻值:330Ω;精度:±1%;功率:100mW;最大工作电压:75V;温度系数:±100ppm/℃;; LCSC Part Name: 330Ω ±1% 100mW 厚膜电阻; Supplier Part: C23138; Manufacturer: UNI-ROYAL(厚声); Supplier Footprint: 0603; JLCPCB Part Class: 基础库; Datasheet: https://atta.szlcsc.com/upload/public/pdf/source/20200306/C422600_1E6D84923E4A46A82E41ADD87F860B5C.pdf; Supplier: LCSC; Type: 厚膜电阻; Tolerance: ±1%; Power(Watts): 100mW; Overload Voltage (Max): 75V; Temperature Coefficient: ±100ppm/℃; Operating Temperature Range: -55℃~+155℃
R41 = 0603WAF2201T5E: 电阻类型:厚膜电阻;阻值:2.2kΩ;精度:±1%;功率:100mW;最大工作电压:75V;温度系数:±100ppm/℃;; LCSC Part Name: 2.2kΩ ±1% 100mW 厚膜电阻; Supplier Part: C4190; Manufacturer: UNI-ROYAL(厚声); Supplier Footprint: 0603; JLCPCB Part Class: 基础库; Datasheet: https://atta.szlcsc.com/upload/public/pdf/source/20200306/C422600_1E6D84923E4A46A82E41ADD87F860B5C.pdf; Supplier: LCSC; Type: 厚膜电阻; Tolerance: ±1%; Power(Watts): 100mW; Overload Voltage (Max): 75V; Temperature Coefficient: ±100ppm/℃; Operating Temperature Range: -55℃~+155℃
U43 U44 = DRV8848PWPR: DRV8848 具有电流调节功能的 18V、2A、H 桥电机驱动器; LCSC Part Name: 4A 有刷直流电机驱动芯片 18V; Supplier Part: C131079; Manufacturer: TI(德州仪器); Supplier Footprint: HTSSOP-16-EP; JLCPCB Part Class: 扩展库; Datasheet: https://www.ti.com/cn/lit/gpn/drv8848; Supplier: LCSC

## Nets
GND: C19.1 C20.2 C21.2 CN2.2 CN4.5 CN4.6 D2.2(A) H1.2 H2.4 H2.7 LED1.C LED2.C P5.2 Q2.2(E) R5.1 R10.2 R13.2 SW3.3 SW3.4 U3.A1(GND) U3.A3(GND) U8.2 U9.2 U10.2 U11.2 U42.6(GND) U42.7(GND) U46.5 U46.7 U46.8 U47.5 U47.7 U47.8 U48.5 U48.7 U48.8 U49.5 U49.7 U49.8
PGND: C1.2 C2.2 C3.2 C4.2 C5.1 C6.1 C7.2 C8.2 C9.2 C10.2 C11.2 C12.2 C13.2 C14.1 C15.1 C16.1 C17.1 C18.1 C22.1 C23.1 C24.1 C25.1 C26.1 C27.1 CN9.1(-) R1.1 R3.2 R5.2 R8.1 U1.2(GND) U2.2(C) U4.2(C) U6.2(GND) U12.3(GND) U12.9(EP) U43.3(AISEN) U43.6(BISEN) U43.13(GND) U43.17(PAD) U44.3(AISEN) U44.6(BISEN) U44.13(GND) U44.17(PAD)
VCC3V3: C15.2 C16.2 C20.1 C21.1 H1.4 P5.1 R6.1 R11.1 R14.2 R15.2 R18.2 R19.2 R20.2 R21.2 R35.1 R38.1 R39.1 U1.5(VOUT) U42.5(VDDIO) U42.8(VDD) U46.2 U47.2 U48.2 U49.2
VCC5V: C8.1 C9.1 C10.1 C11.1 C12.1 C13.1 C14.2 C18.2 R2.1 R4.1 U1.1(VIN) U3.A2(5V) U3.A4(5V) U6.5(IN) U12.4(VOUT) U12.5(VOUT)
VCC5V_EXT: C17.2 CN2.1 CN4.7 H2.5 R7.2 U6.1(OUT)
VCCBAT: C1.1 C2.1 C3.1 C4.1 C5.2 C6.2 C23.2 C24.2 C26.2 C27.2 Q1.2(D) R9.1 R41.1 U12.1(EN) U12.2(VIN) U43.12(VM) U44.12(VM)
B3: H2.8 U3.A41(B3)
B4: H2.6 U3.A39(B4)
B5: H1.12 U3.A37(B5)
B18: H2.2 U3.A23(B18)
B19: H2.9 U3.A22(B19)
B20: H2.3 U3.A21(B20)
B21: H2.1 U3.A20(B21)
B25: R12.2 R13.1 U3.A16(B25)
B27: C19.2 R9.2 R10.1 U3.A14(B27)
B28: H1.6 U3.A13(B28)
B29: H1.14 U3.A12(B29)
B30: H1.8 U3.A11(B30)
B31: H1.10 U3.A10(B31)
C0: U3.B21(C0) U46.4
C1: U3.B22(C1) U46.3
C2: U3.B23(C2) U47.4
C3: U3.B24(C3) U47.3
C8: R22.2 U3.B29(C8)
C9: R23.2 U3.B30(C9)
C10: P5.3 R37.2 R38.2 U3.B31(C10)
C11: P5.6 R39.2 U3.B32(C11) U42.12(CS)
C12: P5.4 R35.2 R36.2 U3.B33(C12)
C13: P5.5 R34.1 U3.B34(C13)
C14: R24.2 U3.B35(C14)
C15: R25.2 U3.B36(C15)
C21: H1.16 U3.B40(C21)
C22: CN2.4 U3.B41(C22)
C23: CN2.3 U3.B42(C23)
C28: R29.2 U3.B47(C28)
C29: R28.1 U3.B48(C29)
C30: R27.2 U3.B49(C30)
C31: R26.1 U3.B50(C31)
CR: U1.3(EN) U3.A9(CR) U6.4(EN)
D0: CN4.1 U3.A50(D0)
D1: CN4.3 U3.A49(D1)
D3: CN4.4 U3.A47(D3)
D4: R33.2 U3.A46(D4)
D5: R32.1 U3.A45(D5)
D6: R31.2 U3.A36(D6)
D7: R30.1 U3.A34(D7)
D8: R16.2 U3.A32(D8)
D9: R17.2 U3.A30(D9)
D13: U3.B1(D13) U49.4
D14: U3.B2(D14) U49.3
D15: U3.B3(D15) U48.4
D16: U3.B4(D16) U48.3
L_B_A: U43.7(BOUT1) U46.6
L_B_B: U43.5(BOUT2) U46.1
L_B_EN_IN: R31.1 U43.10(BIN2)
L_B_PH_IN: R30.2 U43.9(BIN1)
L_F_A: U43.4(AOUT2) U47.6
L_F_B: U43.2(AOUT1) U47.1
L_F_EN_IN: R33.1 U43.15(AIN2)
L_F_PH_IN: R32.2 U43.16(AIN1)
MOTOR_3V3: D2.1(K) R41.2 R42.2 U5.6
NSLEEP: R40.1 U5.5 U43.1(NSLEEP) U44.1(NSLEEP)
R_B_A: U44.4(AOUT2) U48.6
R_B_B: U44.2(AOUT1) U48.1
R_B_EN_IN: R29.1 U44.15(AIN2)
R_B_PH_IN: R28.2 U44.16(AIN1)
R_F_A: U44.7(BOUT1) U49.6
R_F_B: U44.5(BOUT2) U49.1
R_F_EN_IN: R27.1 U44.10(BIN2)
R_F_PH_IN: R26.2 U44.9(BIN1)
$2N1592: Q1.1(G) U41.2
$2N1594: CN9.2(+) D1.1(K) Q1.3(S) U41.3
$2N1598: C7.1 U12.8(SS/TR)
$2N1600: R3.1 R4.2 U12.6(FB)
$2N1601: R2.2 U12.7(PG)
$2N1611: R7.1 U4.1(A)
$2N1614: R8.2 U6.3(ISET)
$2N2042: R6.2 U2.1(A)
$2N6056: D1.2(A) R1.2 U41.1
$3N2358: BUZZER1.1(+) R11.2
$3N2359: BUZZER1.2(-) Q2.3(C)
$3N2360: Q2.1(B) R12.1
$3N2384: R14.1 R16.1 SW3.2
$3N2385: R15.1 R17.1 SW3.1
$3N2388: R18.1 R22.1 U8.1
$3N2389: R19.1 R23.1 U9.1
$3N2390: R20.1 R24.1 U10.1
$3N2391: R21.1 R25.1 U11.1
$3N5860: R34.2 U42.1(SDO/SA0)
$3N6077: R37.1 U42.13(SCL)
$3N6081: R36.1 U42.14(SDA)
$4N2078: LED1.A R40.2
$4N2112: LED2.A R42.1
$4N8420: C25.2 U44.11(VREF) U44.14(VINT)
$4N8638: C22.2 U43.11(VREF) U43.14(VINT)

Not connected (* = marked no-connect by the designer): CN4 2* 8*; CN9 3* 4*; H1 1* 3* 5* 7* 9* 11* 13* 15*; H2 10*; P5 7* 8*; U1 4(NC)*; U3 A5(3V3)* A6(WAKEUP)* A7(3V3)* A8(ONOFF)* A15(B26)* A17(B24)* A18(B23)* A19(B22)* A24(B17)* A25(B16)* A26(B15)* A27(B14)* A28(B13)* A29(B12)* A31(B8)* A33(B7)* A35(B6)* A38(NC)* A40(NC)* A42(NC)* A43(NC)* A44(NC)* A48(D2)* B5(D19)* B6(D20)* B7(D21)* B8(D22)* B9(D23)* B10(D24)* B11(NC)* B12(NC)* B13(NC)* B14(NC)* B15(NC)* B16(NC)* B17(NC)* B18(NC)* B19(NC)* B20(NC)* B25(C4)* B26(C5)* B27(C6)* B28(C7)* B37(C18)* B38(C19)* B39(C20)* B43(C24)* B44(C25)* B45(C26)* B46(C27)*; U5 1* 2* 3* 4*; U41 4* 5* 6*; U42 2(SDX)* 3(SCX)* 4(INT1)* 9(INT2)* 10(OCS_AUX)* 11(SDO_AUX)*; U43 8(NFAULT)*; U44 8(NFAULT)*

## Notes on the sheets
sheet 2
- 电源接口
- 5V电源
- 3V3电源
- 单点接地（功率地和数字地）
- 5V上电时序控制开关
sheet 3
- 屏幕
- 姿态传感器(备份，连逐飞的)
- ToF传感器
- 无线串口
- 驱动信号右
- 电压检测
- openart
- 蜂鸣器
- 轻触开关
- 驱动信号左
- 使用反向线
- SPI-WIFI
- 拨码开关
- 编码器/电机
- 定位孔
- 二维码
- 智能车逐飞摄像头固定孔
- 姿态传感器(自制的)
sheet 4
- 左电机驱动电路
- 右电机驱动电路
- 使能开关
- 电源指示
